# Altium schematic sheet EPS_V1.SchDoc
size A4; SheetNumber: 1; SheetTotal: 21
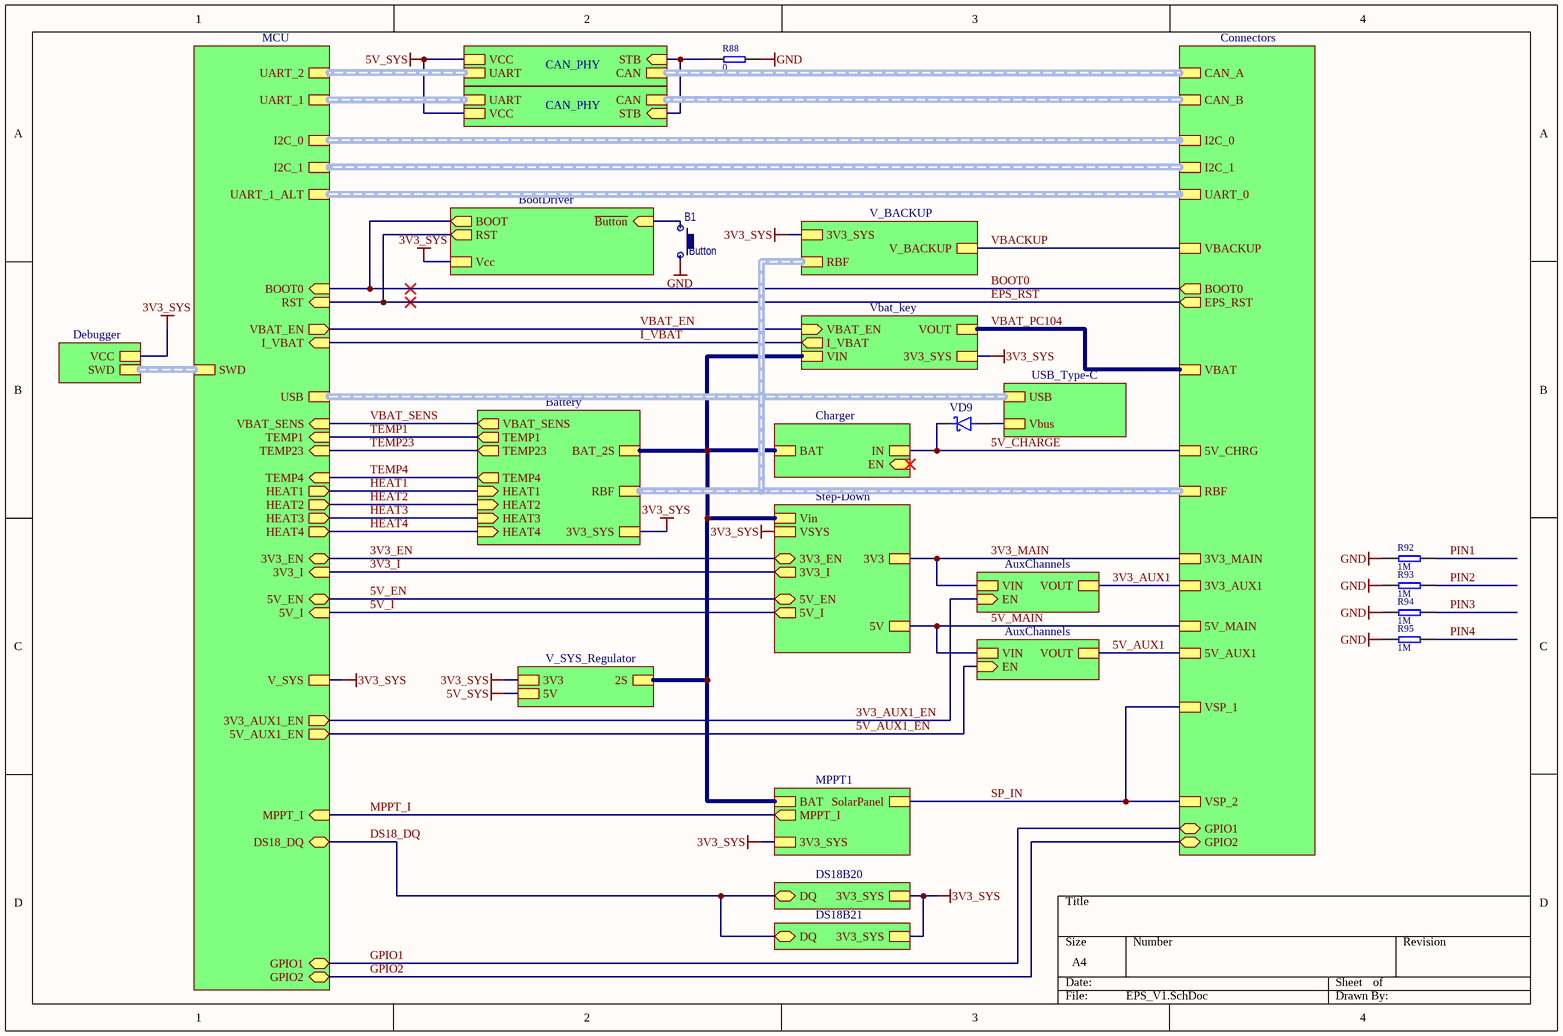
[diagram p0: EPS_V1.SchDoc]

## Parts
B1  Button  [button]
R88  value 0  [RES 0402]
R92  value 1M  [RES 0402]
R93  value 1M  [RES 0402]
R94  value 1M  [RES 0402]
R95  value 1M  [RES 0402]
VD9  (no value)  [SOD-123]

## Sub-sheets
AuxChannels = AuxChannels.SchDoc: VIN, VOUT, EN (in)
AuxChannels = AuxChannels.SchDoc: VIN, VOUT, EN (in)
Battery = Battery.SchDoc: BAT_2S, VBAT_SENS (out), HEAT2 (in), 3V3_SYS, RBF (harness RBF), HEAT4 (in), TEMP23 (out), TEMP4 (out), HEAT3 (in), TEMP1 (out), HEAT1 (in)
BootDriver = BootDriver.SchDoc: ~{Button} (in), RST (out), BOOT (out), Vcc
CAN_PHY = CAN_PHY.SchDoc: VCC, STB (in), CAN (harness CAN), UART (harness UART)
CAN_PHY = CAN_PHY.SchDoc: VCC, STB (in), CAN (harness CAN), UART (harness UART)
Charger = Charger.SchDoc: BAT, IN, EN (in)
Connectors = Connectors.SchDoc: VSP_2, VSP_1, BOOT0 (out), EPS_RST (out), 5V_MAIN, VBAT, 3V3_MAIN, VBACKUP, I2C_1 (harness I2C), UART_0 (harness UART), I2C_0 (harness I2C), CAN_A (harness CAN), CAN_B (harness CAN), 5V_CHRG, RBF (harness RBF), 3V3_AUX1, 5V_AUX1, GPIO1 (bidir), GPIO2 (bidir)
Debugger = Debugger.SchDoc: SWD (harness SWD), VCC
DS18B20 = DS18B20.SchDoc: DQ (bidir), 3V3_SYS
DS18B21 = DS18B20.SchDoc: DQ (bidir), 3V3_SYS
MCU = MCU.SchDoc: SWD (harness SWD), BOOT0 (in), RST (in), 3V3_I (in), 5V_I (in), 3V3_EN (bidir), 5V_EN (bidir), VBAT_SENS (in), UART_2 (harness UART), I2C_1 (harness I2C), UART_1 (harness UART), I2C_0 (harness I2C), V_SYS, USB (harness USB), UART_1_ALT (harness UART), TEMP1 (in), TEMP23 (in), TEMP4 (in), HEAT1 (out), HEAT2 (out), HEAT3 (out), HEAT4 (out), VBAT_EN (out), I_VBAT (in), 3V3_AUX1_EN (out), 5V_AUX1_EN (out), MPPT_I (in), DS18_DQ (bidir), GPIO1 (bidir), GPIO2 (bidir)
MPPT1 = MPPT.SchDoc: SolarPanel, BAT, 3V3_SYS, MPPT_I (out)
Step-Down = DC-step-down.SchDoc: Vin, 3V3_EN (bidir), 3V3_I (out), VSYS, 3V3, 5V_I (out), 5V_EN (bidir), 5V
USB_Type-C = USB_Type-C.SchDoc: USB (harness USB), Vbus
V_BACKUP = V_BACKUP.SchDoc: V_BACKUP, RBF (harness RBF), 3V3_SYS
V_SYS_Regulator = V_SYS_Regulator.SchDoc: 2S, 3V3, 5V
Vbat_key = Vbat_key.SchDoc: VIN, VBAT_EN (in), VOUT, I_VBAT (out), 3V3_SYS

## Nets
3V3_SYS: sheet Battery/3V3_SYS, sheet Step-Down/VSYS, sheet MPPT1/3V3_SYS, sheet MCU/V_SYS, sheet V_SYS_Regulator/3V3, sheet Vbat_key/3V3_SYS, sheet V_BACKUP/3V3_SYS, sheet DS18B20/3V3_SYS, sheet DS18B21/3V3_SYS, sheet BootDriver/Vcc, sheet Debugger/VCC
5V_SYS: sheet CAN_PHY/VCC, sheet CAN_PHY/VCC, sheet V_SYS_Regulator/5V
GND: B1.1 R88.2 R92.1 R93.1 R94.1 R95.1
3V3_AUX1: sheet Connectors/3V3_AUX1, sheet AuxChannels/VOUT
3V3_AUX1_EN: sheet MCU/3V3_AUX1_EN, sheet AuxChannels/EN
3V3_EN: sheet Step-Down/3V3_EN, sheet MCU/3V3_EN
3V3_I: sheet Step-Down/3V3_I, sheet MCU/3V3_I
3V3_MAIN: sheet Step-Down/3V3, sheet Connectors/3V3_MAIN, sheet AuxChannels/VIN
5V_AUX1: sheet Connectors/5V_AUX1, sheet AuxChannels/VOUT
5V_AUX1_EN: sheet MCU/5V_AUX1_EN, sheet AuxChannels/EN
5V_CHARGE: VD9.C(Cathode) ; sheet Charger/IN, sheet Connectors/5V_CHRG
5V_EN: sheet Step-Down/5V_EN, sheet MCU/5V_EN
5V_I: sheet Step-Down/5V_I, sheet MCU/5V_I
5V_MAIN: sheet Step-Down/5V, sheet Connectors/5V_MAIN, sheet AuxChannels/VIN
BOOT0: sheet MCU/BOOT0, sheet Connectors/BOOT0, sheet BootDriver/BOOT
DS18_DQ: sheet MCU/DS18_DQ, sheet DS18B20/DQ, sheet DS18B21/DQ
EPS_RST: sheet MCU/RST, sheet Connectors/EPS_RST, sheet BootDriver/RST
GPIO1: sheet MCU/GPIO1, sheet Connectors/GPIO1
GPIO2: sheet MCU/GPIO2, sheet Connectors/GPIO2
HEAT1: sheet Battery/HEAT1, sheet MCU/HEAT1
HEAT2: sheet Battery/HEAT2, sheet MCU/HEAT2
HEAT3: sheet Battery/HEAT3, sheet MCU/HEAT3
HEAT4: sheet Battery/HEAT4, sheet MCU/HEAT4
I_VBAT: sheet MCU/I_VBAT, sheet Vbat_key/I_VBAT
MPPT_I: sheet MPPT1/MPPT_I, sheet MCU/MPPT_I
PIN1: R92.2
PIN2: R93.2
PIN3: R94.2
PIN4: R95.2
SP_IN: sheet MPPT1/SolarPanel, sheet Connectors/VSP_2, sheet Connectors/VSP_1
TEMP1: sheet Battery/TEMP1, sheet MCU/TEMP1
TEMP4: sheet Battery/TEMP4, sheet MCU/TEMP4
TEMP23: sheet Battery/TEMP23, sheet MCU/TEMP23
VBACKUP: sheet Connectors/VBACKUP, sheet V_BACKUP/V_BACKUP
VBAT_EN: sheet MCU/VBAT_EN, sheet Vbat_key/VBAT_EN
VBAT_PC104: sheet Connectors/VBAT, sheet Vbat_key/VOUT
VBAT_SENS: sheet Battery/VBAT_SENS, sheet MCU/VBAT_SENS
NetB1_2: B1.2 ; sheet BootDriver/~{Button}
NetR88_1: R88.1 ; sheet CAN_PHY/STB, sheet CAN_PHY/STB
NetVD9_A: VD9.A(Anode) ; sheet USB_Type-C/Vbus
(unnamed): sheet Battery/BAT_2S, sheet Step-Down/Vin, sheet MPPT1/BAT, sheet Charger/BAT, sheet V_SYS_Regulator/2S, sheet Vbat_key/VIN

## Buses and harness runs
harness sheet Battery/RBF = sheet Connectors/RBF = sheet V_BACKUP/RBF
harness sheet CAN_PHY/CAN = sheet Connectors/CAN_A
harness sheet CAN_PHY/CAN = sheet Connectors/CAN_B
harness sheet CAN_PHY/UART = sheet MCU/UART_1
harness sheet CAN_PHY/UART = sheet MCU/UART_2
harness sheet Connectors/I2C_0 = sheet MCU/I2C_0
harness sheet Connectors/I2C_1 = sheet MCU/I2C_1
harness sheet Connectors/UART_0 = sheet MCU/UART_1_ALT
harness sheet Debugger/SWD = sheet MCU/SWD
harness sheet MCU/USB = sheet USB_Type-C/USB

## Library data of the parts
R88 R92-R95 = !Resistor: Resistor; IsSMT: NoSMT
VD9 = DiodeS: Diode Shottky; IsSMT: NoSMT